# Altium schematic sheet Sensors.SchDoc
size A4; SheetNumber: 5; SheetTotal: 7
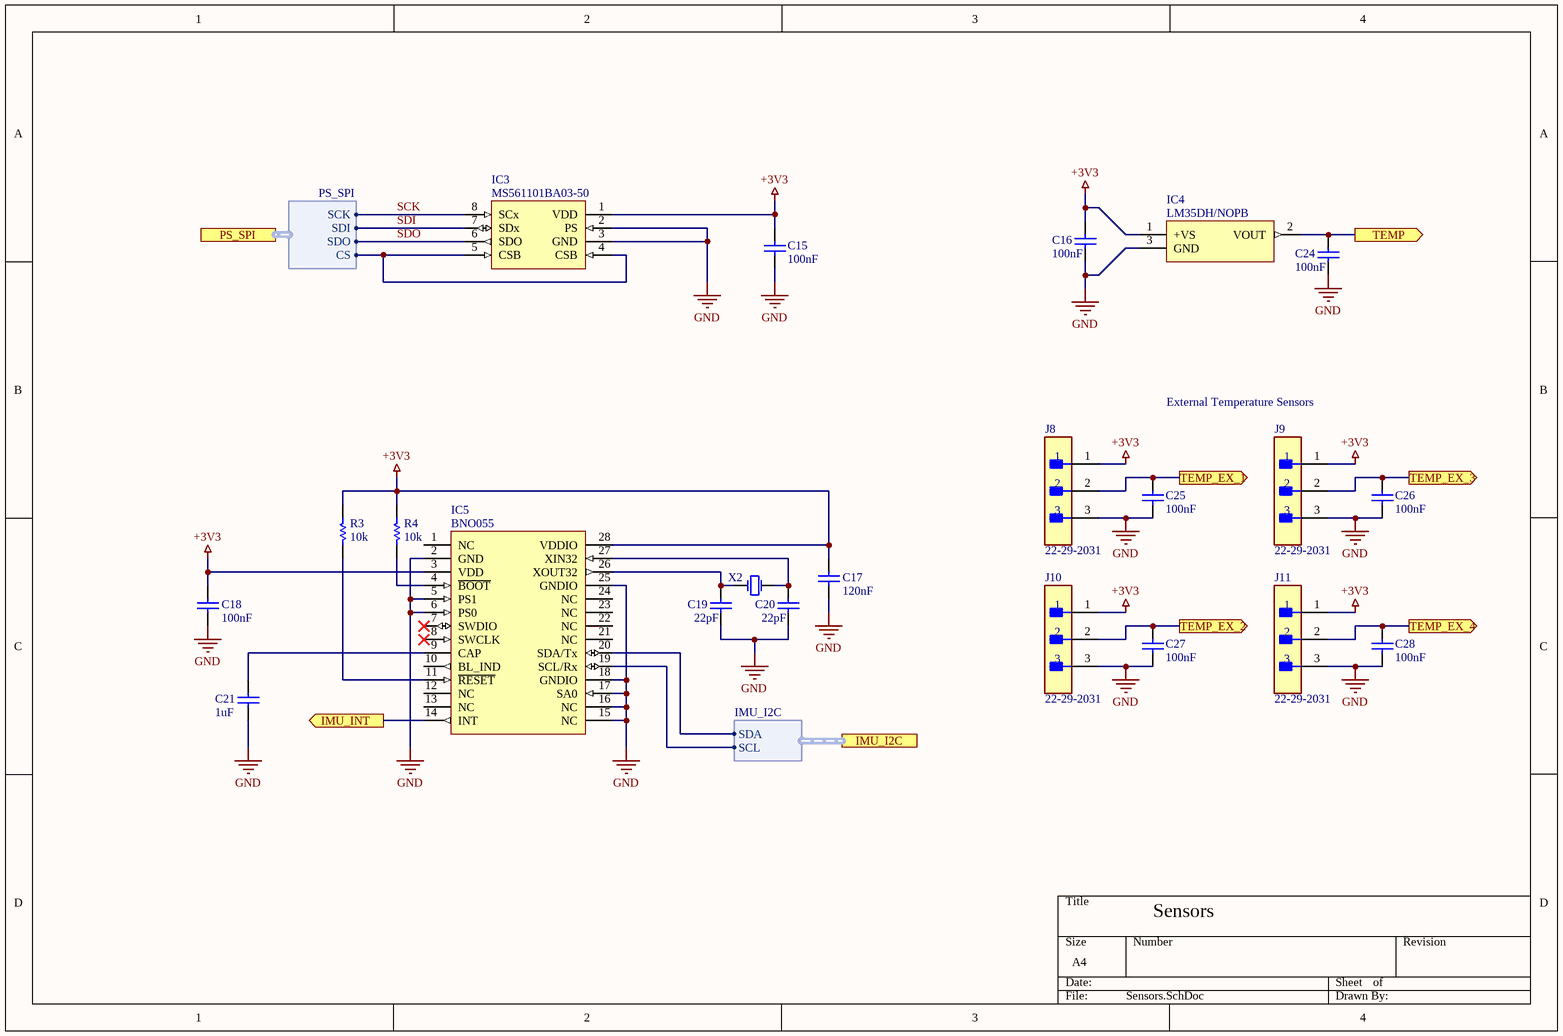
[diagram p0: Sensors.SchDoc]

## Parts
C15  value 100nF  [CAPC1608X10N]  (hidden comment: C0603C104M5RACTU)
C16  Capacitance: 100nF  [CAPC1608X10N]  (hidden comment: C0603C104M5RACTU)
C17  value 120nF  [CAPC1608X10N]  (hidden comment: C0603C124K4RACTU)
C18  value 100nF  [CAPC1608X10N]  (hidden comment: C0603C104M5RACTU)
C19  value 22pF  [CAPC1005X05N]  (hidden comment: C0402C220K5GACTU)
C20  value 22pF  [CAPC1005X05N]  (hidden comment: C0402C220K5GACTU)
C21  value 1uF  [CAPC1608X10N]  (hidden comment: C0603C105K8PACTU)
C24  Capacitance: 100nF  [CAPC1608X10N]  (hidden comment: C0603C104M5RACTU)
C25  value 100nF  [CAPC1608X10N]  (hidden comment: C0603C104M5RACTU)
C26  value 100nF  [CAPC1608X10N]  (hidden comment: C0603C104M5RACTU)
C27  value 100nF  [CAPC1608X10N]  (hidden comment: C0603C104M5RACTU)
C28  value 100nF  [CAPC1608X10N]  (hidden comment: C0603C104M5RACTU)
IC3  MS561101BA03-50  [MS561101BA03-50-Footprint-1]
IC4  LM35DH/NOPB  [LM35DH_NOPB-Footprint-1]
IC5  BNO055  [BNO055-Footprint-1]
J8  22-29-2031  [FP-22-29-2031-MFG]
J9  22-29-2031  [FP-22-29-2031-MFG]
J10  22-29-2031  [FP-22-29-2031-MFG]
J11  22-29-2031  [FP-22-29-2031-MFG]
R3  value 10k  [RESC1608X06N]  (hidden comment: CRCW060310K0FKEA)
R4  value 10k  [RESC1608X06N]  (hidden comment: CRCW060310K0FKEA)
X2  ABS07-32.768KHZ-T  [ABS07-32.768KHZ-T-Footprint-1]  (value not drawn)

## Ports
IMU_I2C (harness IMU_I2C, see Top Level[2A], Flight_Computer[2D]), IMU_INT (out, see Top Level[2B], Flight_Computer[3D]), PS_SPI (harness PS_SPI, see Top Level[2A], Flight_Computer[2C]), TEMP (out, see Top Level[2A], Flight_Computer[3B]), TEMP_EX_1 (out, see Top Level[2B], Flight_Computer[2C]), TEMP_EX_2 (out, see Top Level[2B], Flight_Computer[2C]), TEMP_EX_3 (out, see Top Level[2B], Flight_Computer[2C]), TEMP_EX_4 (out, see Top Level[2B], Flight_Computer[2C])

## Harnesses
PS_SPI: SCK, SDI, SDO, CS
IMU_I2C: SCL, SDA

## Nets
+3V3: C15.2 C16.2 C17.2 C18.2 IC3.1(VDD) IC4.1(+VS) IC5.3(VDD) IC5.28(VDDIO) J8.1 J9.1 J10.1 J11.1 R3.2 R4.2
GND: C15.1 C16.1 C17.1 C18.1 C19.1 C20.1 C21.1 C24.1 C25.1 C26.1 C27.1 C28.1 IC3.2(PS) IC3.3(GND) IC4.3(GND) IC5.2(GND) IC5.5(PS1) IC5.6(PS0) IC5.15(NC) IC5.16(NC) IC5.17(SA0) IC5.18(GNDIO) IC5.25(GNDIO) J8.3 J9.3 J10.3 J11.3
IMU_INT: IC5.14(INT) ; port IMU_INT
SCK: IC3.8(SCx) ; port PS_SPI.SCK
SDI: IC3.7(SDx) ; port PS_SPI.SDI
SDO: IC3.6(SDO) ; port PS_SPI.SDO
TEMP: C24.2 IC4.2(VOUT) ; port TEMP
TEMP_EX_1: C25.2 J8.2 ; port TEMP_EX_1
TEMP_EX_2: C27.2 J10.2 ; port TEMP_EX_2
TEMP_EX_3: C26.2 J9.2 ; port TEMP_EX_3
TEMP_EX_4: C28.2 J11.2 ; port TEMP_EX_4
NetC19_2: C19.2 IC5.26(XOUT32) X2.1(OSC1)
NetC20_2: C20.2 IC5.27(XIN32) X2.2(OSC2)
NetC21_2: C21.2 IC5.9(CAP)
NetIC3_4: IC3.4(CSB) IC3.5(CSB) ; port PS_SPI.CS
NetIC5_4: IC5.4(~{BOOT}) R4.1
NetIC5_11: IC5.11(~{RESET}) R3.1
NetIC5_19: IC5.19(SCL/Rx) ; port IMU_I2C.SCL
NetIC5_20: IC5.20(SDA/Tx) ; port IMU_I2C.SDA

Not connected (* = marked no-connect by the designer): IC5 1(NC) 7(SWDIO)* 8(SWCLK)* 10(BL_IND) 12(NC) 13(NC) 21(NC) 22(NC) 23(NC) 24(NC)

## Notes on the sheet
- External Temperature Sensors
- Sensors

## Library data of the parts
C15 C18 C25-C28 = CMP-00038-5: Cap Ceramic 0.1uF 50V X7R 20% SMD 0603 125C T/R; Dissipation Factor: 2.5%; Dielectric Material: Ceramic; Voltage Rating: 50V; Lead Pitch: 0.7mm; Package Quantity: 1; Case Code (Metric): 1608; Tolerance: 20%; Termination: SMD/SMT; Min Operating Temperature: -55°C; Height: 0.8mm; Voltage Rating (DC): 50V; Contact Plating: Tin,Matte; Case/Package: 0603; Capacitance: 100nF; Length: 1.6mm; Dielectric: X7R; Depth: 0.8mm; Mount: Surface Mount,PCB; Thickness: 0.034inch; Width: 0.031inch; REACH SVHC: No SVHC; Packaging: Tape and Reel; Case Code (Imperial): 0603; Max Operating Temperature: 125°C; Radiation Hardening: No; JLC_PN: C14663
C16 C24 = CMP-00038-5: Cap Ceramic 0.1uF 50V X7R 20% SMD 0603 125C T/R; Value: 100nF; Dissipation Factor: 2.5%; Min Operating Temperature: -55°C; Contact Plating: Tin,Matte; Height: 0.8mm; Voltage Rating: 50V; REACH SVHC: No SVHC; Max Operating Temperature: 125°C; Termination: SMD/SMT; Package Quantity: 1; Packaging: Tape and Reel; Width: 0.031inch; Depth: 0.8mm; Dielectric: X7R; Tolerance: 20%; Lead Pitch: 0.7mm; Thickness: 0.034inch; Length: 1.6mm; Dielectric Material: Ceramic; Radiation Hardening: No; Voltage Rating (DC): 50V; Case/Package: 0603; Case Code (Metric): 1608; Mount: Surface Mount,PCB; Case Code (Imperial): 0603; JLC_PN: C14663
C17 = CMP-00213-1: MLCC CAPACITOR, 0.12UF, 16V, X7R, 10%, 0603, FULL REEL; Product Range:C Series; Capacitance:0.12 F; Capacitance Tolerance: 10%; Dielectric Characteristic:X7R; Voltage Rating:16V; Ceramic Capacitor Case:0603 [1608 Metric] ;RoHS Compliant: Yes; Dissipation Factor: 3.5%; Packaging: Tape and Reel; Height: 0.8mm; Termination: SMD/SMT; Tolerance: 10%; Package Quantity: 1; REACH SVHC: No SVHC; Dielectric Material: Ceramic; Case/Package: 0603; Radiation Hardening: No; Max Operating Temperature: 125°C; RoHS Compliant: Yes; Case Code (Metric): 1608; Width: 0.031inch; Thickness: 0.034inch; Case Code (Imperial): 0603; Voltage Rating (DC): 16V; Dielectric: X7R; Voltage Rating: 16V; Length: 1.6mm; Series: C; Lead Pitch: 0.7mm; Depth: 0.8mm; Min Operating Temperature: -55°C; Capacitance: 120nF; Mount: Surface Mount
C19 C20 = CMP-00083-1: CAP CER 22PF 50V C0G/NP0 0402; Dielectric: C0G; Tolerance: 10%; Dissipation Factor: 0.1%; Dielectric Material: Ceramic; Lead Pitch: 0.3mm; Case Code (Imperial): 0402; Height: 0.5mm; Depth: 0.5mm; Voltage Rating (DC): 50V; Mount: Surface Mount; Voltage Rating: 50V; Width: 0.02inch; Capacitance: 22pF; Radiation Hardening: No; Max Operating Temperature: 125°C; Length: 1mm; Min Operating Temperature: -55°C; Package Quantity: 1; Case Code (Metric): 1005; Termination: SMD/SMT; Case/Package: 0402; REACH SVHC: No SVHC; Lead Free: Lead Free; Packaging: Tape and Reel; Thickness: 0.022inch
C21 = CMP-00045-2: Cap Ceramic 1uF 10V X5R 10% SMD 0603 85°C Paper T/R; Capacitance: 1uF; Voltage Rating (DC): 10V; Case/Package: 0603; Height: 0.8mm; Tolerance: 10%; Width: 0.031inch; Lead Free: Lead Free; Mount: Surface Mount; Length: 1.6mm; Number of Pins: 2; Radiation Hardening: No; Dielectric: X5R; Voltage: 10V; Depth: 0.8mm; Weight: 7.1E-05oz; REACH SVHC: No SVHC; Package Quantity: 1; Max Operating Temperature: 85°C; Case Code (Imperial): 0603; Thickness: 0.035inch; Min Operating Temperature: -55°C; Dielectric Material: Ceramic; Case Code (Metric): 1608; Packaging: Tape and Reel; Voltage Rating: 10V; Termination: SMD/SMT; JLC_PN: C15849
IC3 = CMP-00182-2: SENSOR SOLUTIONS - TE CONNECTIVITY - MS561101BA03-50 - MS5611-BT M-CAPS 3X5X1MM T&R / T&R; Operating Pressure: 17.4PSI; Pressure Type: Absolute; Output Type: SPI,I2C; Port Style: No Port; Operating Supply Voltage: 3.6V; Max Pressure: 87.02PSI; Max Operating Temperature: 85°C; Min Operating Temperature: -40°C; Case/Package: SMD/SMT; Lead Free: Lead Free; Number of Pins: 8; Termination: SMD/SMT
IC4 = CMP-00206-1: TEXAS INSTRUMENTS LM35DH/NOPB Temperature Sensor IC, Voltage,  0.6C, 0 C, +100 C, TO-46, 3 Pins; Output Voltage: 6V; Output Type: Analog Voltage,Voltage,Analog; Interface: Analog; Quiescent Current: 56uA; Max Supply Voltage: 30V; Min Supply Voltage: 4V; Output Current: 10mA; Nominal Supply Current: 56.2uA; Contact Plating: Copper,Tin,Silver; Min Operating Temperature: -40°C; Radiation Hardening: No; Number of Pins: 3; Packaging: Bulk; Package Quantity: 1000; Lead Free: Lead Free; REACH SVHC: No SVHC; Mount: Through Hole; Max Operating Temperature: 110°C; Case/Package: TO-46
IC5 = CMP-00179-4: IMU ACCEL/GYRO/MAG I2C 28LGA; Sensor Type: Accelerometer,Gyroscope,Magnetometer,3 Axis; Min Operating Temperature: -40°C; Lead Free: Lead Free; Mount: Surface Mount; Packaging: Tape and Reel; Output Type: I2C; Max Operating Temperature: 85°C; Case/Package: LGA; JLC_PN: C93216
J8-J11 = CMP-04776-000327-1: CONN HEADER VERT 3POS 2.54MM; Contact Resistance: 10mR; Number of Positions: 3; Voltage Rating: 250V; Gender: Male; Connector Type: Male Pin; Current Rating: 4A; Packaging: Bulk; Housing Material: Nylon; Min Operating Temperature: 0°C; Color: Natural; RoHS Compliant: Yes; Housing Color: White; Number of Rows: 1; Pitch: 2.54mm; Mount: Through Hole; Fastening Type: Friction; Length: 7.62mm; Depth: 5.8mm; Contact Material: Brass; Max Operating Temperature: 75°C; Number of Contacts: 3; Contact Type: Male Pin; Working Voltage: 250V; Orientation: Straight; Lead Pitch: 2.54mm; Radiation Hardening: No; Termination: Solder; Contact Plating: Gold; Contact Mating Length: 0.295inch; Series: KK® 6410
R3 R4 = CMP-00042-5: VISHAY - CRCW060310K0FKEA - SMD Chip Resistor, 0603 [1608 Metric], 10 kohm, CRCW e3 Series, 75 V, Thick Film, 100 mW; Voltage Rating: 75V; Temperature Coefficient: 100ppm/°C; Resistance: 10kR; Power Rating: 100mW; Tolerance: 1%; Number of Terminations: 2; Termination: SMD/SMT; Weight: 7.1E-05oz; Contact Plating: Tin,Lead; Max Operating Temperature: 155°C; Voltage Rating (DC): 75V; Military Standard: Not; Min Operating Temperature: -55°C; Depth: 0.85mm; Lead Free: Lead Free; Width: 0.033inch; Max Power Dissipation: 100mW; Features: Automotive AEC-Q200; Number of Pins: 2; Package Quantity: 10; Case/Package: 0603; Height: 0.45mm; Radiation Hardening: No; REACH SVHC: Unknown; Packaging: Tape and Reel; Length: 1.55mm; Case Code (Metric): 1608; Case Code (Imperial): 0603; Composition: Thick Film; JLC_PN: C25804
X2 = CMP-00187-2: Crystal; Ulta-Mini; 3.2 x 1.5 x 0.9mm; 32.768KHZ; 12.5pf; 20ppm -40+85C; SMD; T/R; ESR (Equivalent Series Resistance): 70kR; Tolerance: 20ppm; Width: 0.061inch; Number of Pins: 2; Packaging: Tape and Reel; Package Quantity: 3000; Depth: 1.5mm; Height: 0.035inch; Min Operating Temperature: -40°C; Case/Package: CSMD; REACH SVHC: No SVHC; Radiation Hardening: No; Termination: SMD/SMT; Lead Free: Lead Free; Max Operating Temperature: 85°C; Load Capacitance: 12.5pF; Frequency: 32.768kHz; Frequency Tolerance: 20ppm; Length: 3.2mm; Series Resistance: 70kR; JLC_PN: C130253